# EAGLE design 2p_behavior (EAGLE 9.3.2)
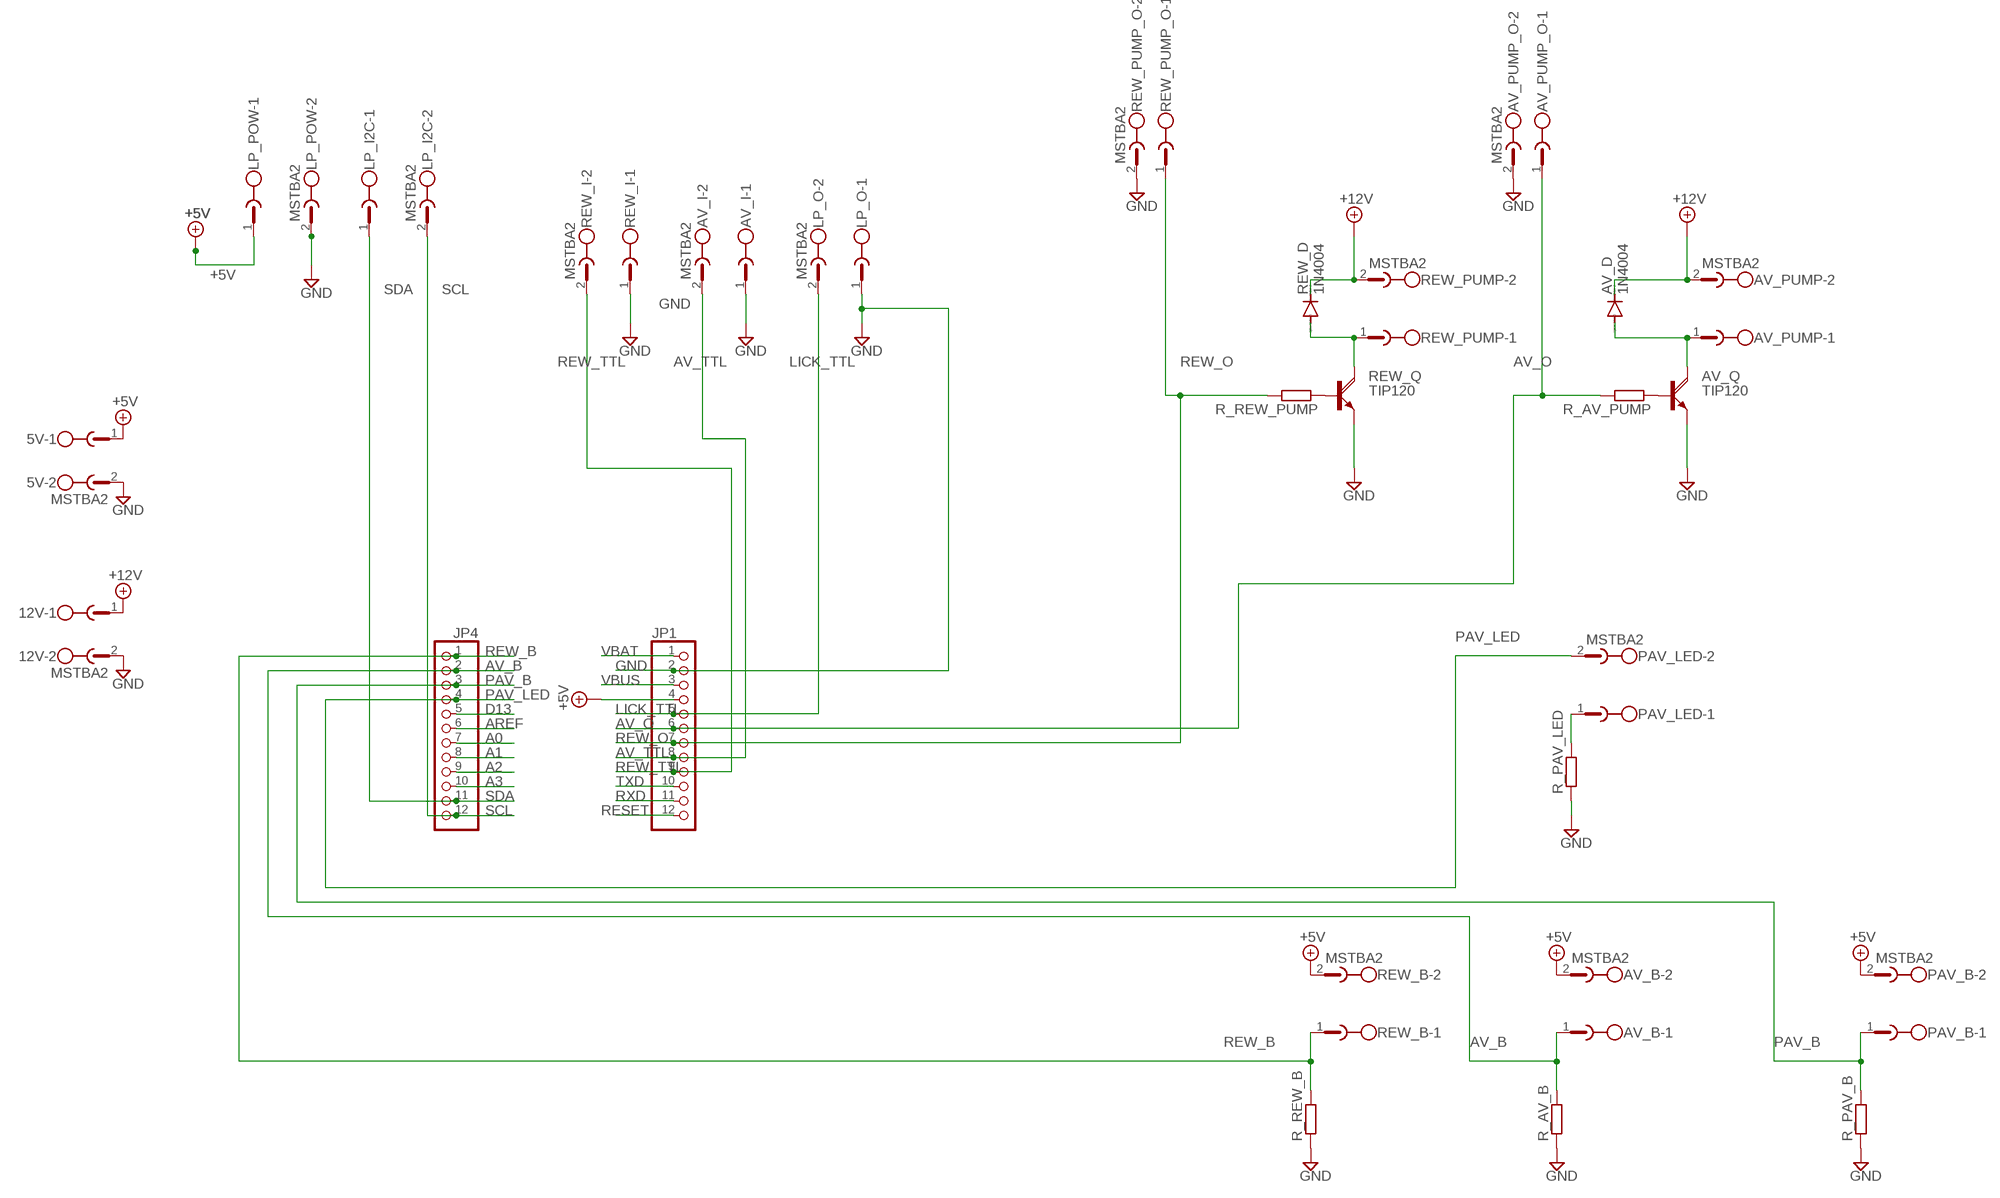
[diagram p0: schematic, sheet 1]

## Parts
5V  MSTBA2  [MSTBA2]
12V  MSTBA2  [MSTBA2]
AV_B  MSTBA2  [MSTBA2]
AV_D  1N4004  [DO41-10]
AV_I  MSTBA2  [MSTBA2]
AV_PUMP  MSTBA2  [MSTBA2]
AV_PUMP_O  MSTBA2  [MSTBA2]
AV_Q  TIP120  [TO220AH]
JP1  PINHD-1X12-CB  [1X12-CB]
JP4  PINHD-1X12-CB  [1X12-CB]
LP_I2C  MSTBA2  [MSTBA2]
LP_O  MSTBA2  [MSTBA2]
LP_POW  MSTBA2  [MSTBA2]
PAV_B  MSTBA2  [MSTBA2]
PAV_LED  MSTBA2  [MSTBA2]
R_AV_B  R-EU_0207/5V  [0207/5V]
R_AV_PUMP  R-EU_0207/5V  [0207/5V]
R_PAV_B  R-EU_0207/5V  [0207/5V]
R_PAV_LED  R-EU_0207/5V  [0207/5V]
R_REW_B  R-EU_0207/5V  [0207/5V]
R_REW_PUMP  R-EU_0207/5V  [0207/5V]
REW_B  MSTBA2  [MSTBA2]
REW_D  1N4004  [DO41-10]
REW_I  MSTBA2  [MSTBA2]
REW_PUMP  MSTBA2  [MSTBA2]
REW_PUMP_O  MSTBA2  [MSTBA2]
REW_Q  TIP120  [TO220AH]

## Nets
+5V: 5V.1 AV_B.2 JP1.4 LP_POW.1 PAV_B.2 REW_B.2
+12V: 12V.1 AV_D.C AV_PUMP.2 REW_D.C REW_PUMP.2
A0: JP4.7
A1: JP4.8
A2: JP4.9
A3: JP4.10
AREF: JP4.6
AV_B: AV_B.1 JP4.2 R_AV_B.2
AV_O: AV_PUMP_O.1 JP1.6 R_AV_PUMP.2
AV_TTL: AV_I.2 JP1.8
D13: JP4.5
GND: 5V.2 12V.2 AV_I.1 AV_PUMP_O.2 AV_Q.E JP1.2 LP_O.1 LP_POW.2 R_AV_B.1 R_PAV_B.1 R_PAV_LED.1 R_REW_B.1 REW_I.1 REW_PUMP_O.2 REW_Q.E
LICK_TTL: JP1.5 LP_O.2
N$1: PAV_LED.1 R_PAV_LED.2
N$2: R_REW_PUMP.1 REW_Q.B
N$3: REW_D.A REW_PUMP.1 REW_Q.C
N$4: AV_Q.B R_AV_PUMP.1
N$5: AV_D.A AV_PUMP.1 AV_Q.C
PAV_B: JP4.3 PAV_B.1 R_PAV_B.2
PAV_LED: JP4.4 PAV_LED.2
RESET: JP1.12
REW_B: JP4.1 R_REW_B.2 REW_B.1
REW_O: JP1.7 R_REW_PUMP.2 REW_PUMP_O.1
REW_TTL: JP1.9 REW_I.2
RXD: JP1.11
SCL: JP4.12 LP_I2C.2
SDA: JP4.11 LP_I2C.1
TXD: JP1.10
VBAT [power]: JP1.1
VBUS [power]: JP1.3

## Library data of the parts
5V 12V AV_B AV_I AV_PUMP AV_PUMP_O LP_I2C LP_O LP_POW PAV_B PAV_LED REW_B REW_I REW_PUMP REW_PUMP_O = con-phoenix-508:MSTBA2: PHOENIX; MF: FARNELL; MPN: 1757242; OC_FARNELL: 3705171; OC_NEWARK: 71C4161
AV_D REW_D = diode:1N4004: DIODE general purpose rectifier, 1 A
AV_Q REW_Q = transistor-power:TIP120: NPN DARLINGTON TRANSISTOR
JP1 JP4 = adafruit:PINHD-1X12: PIN HEADER
R_AV_B R_AV_PUMP R_PAV_B R_PAV_LED R_REW_B R_REW_PUMP = rcl:R-EU_: RESISTOR, European symbol; SPICEPREFIX: R

## Net classes
1 power: width 0.305 mm

## Board
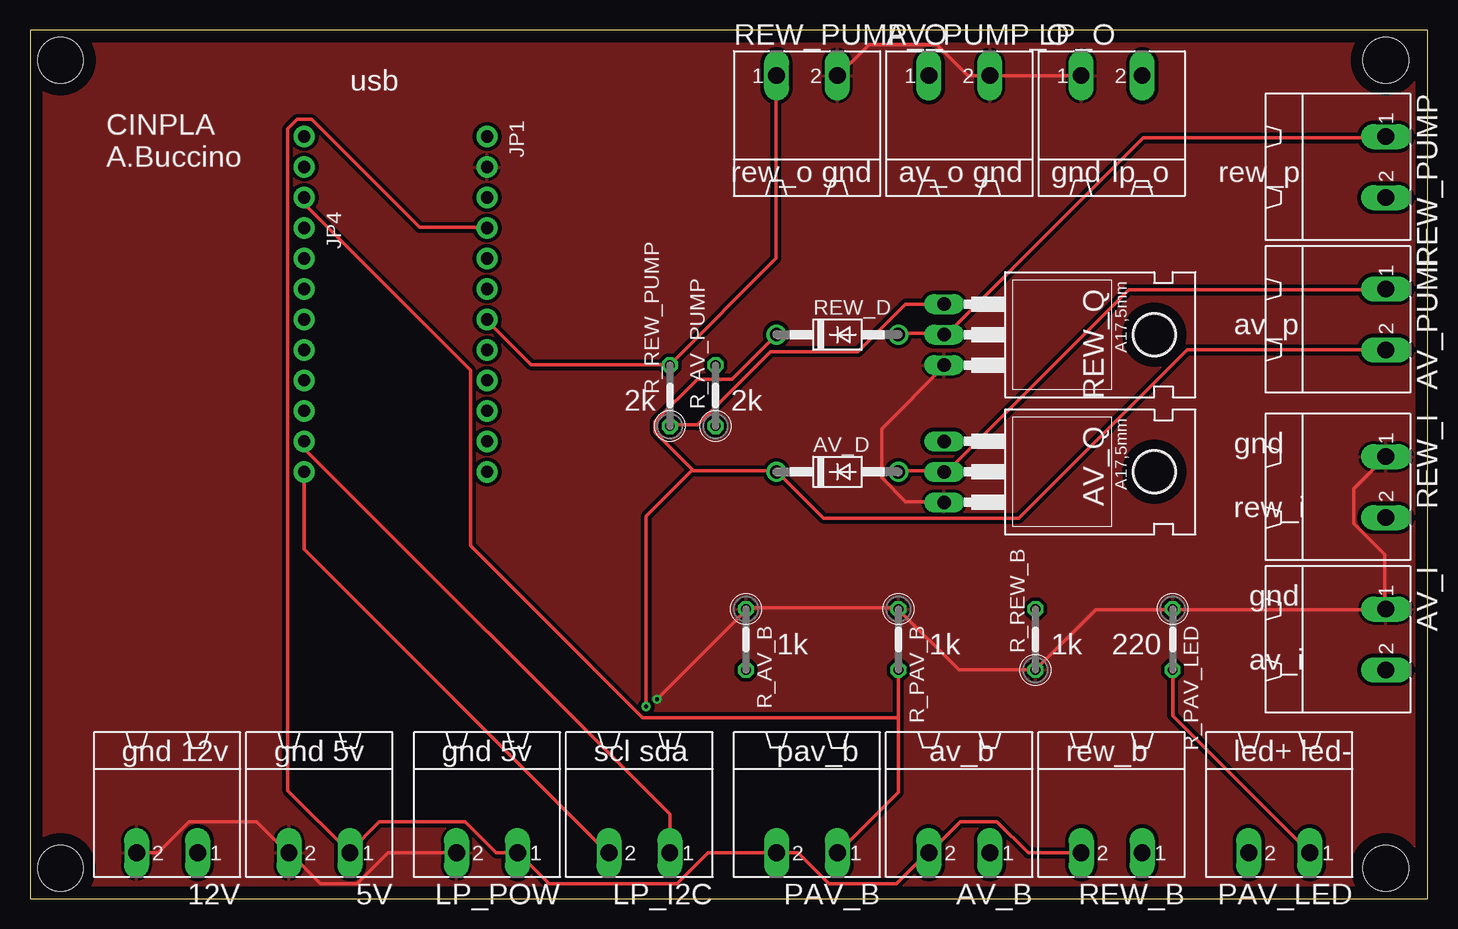
[diagram p1: board, top side]
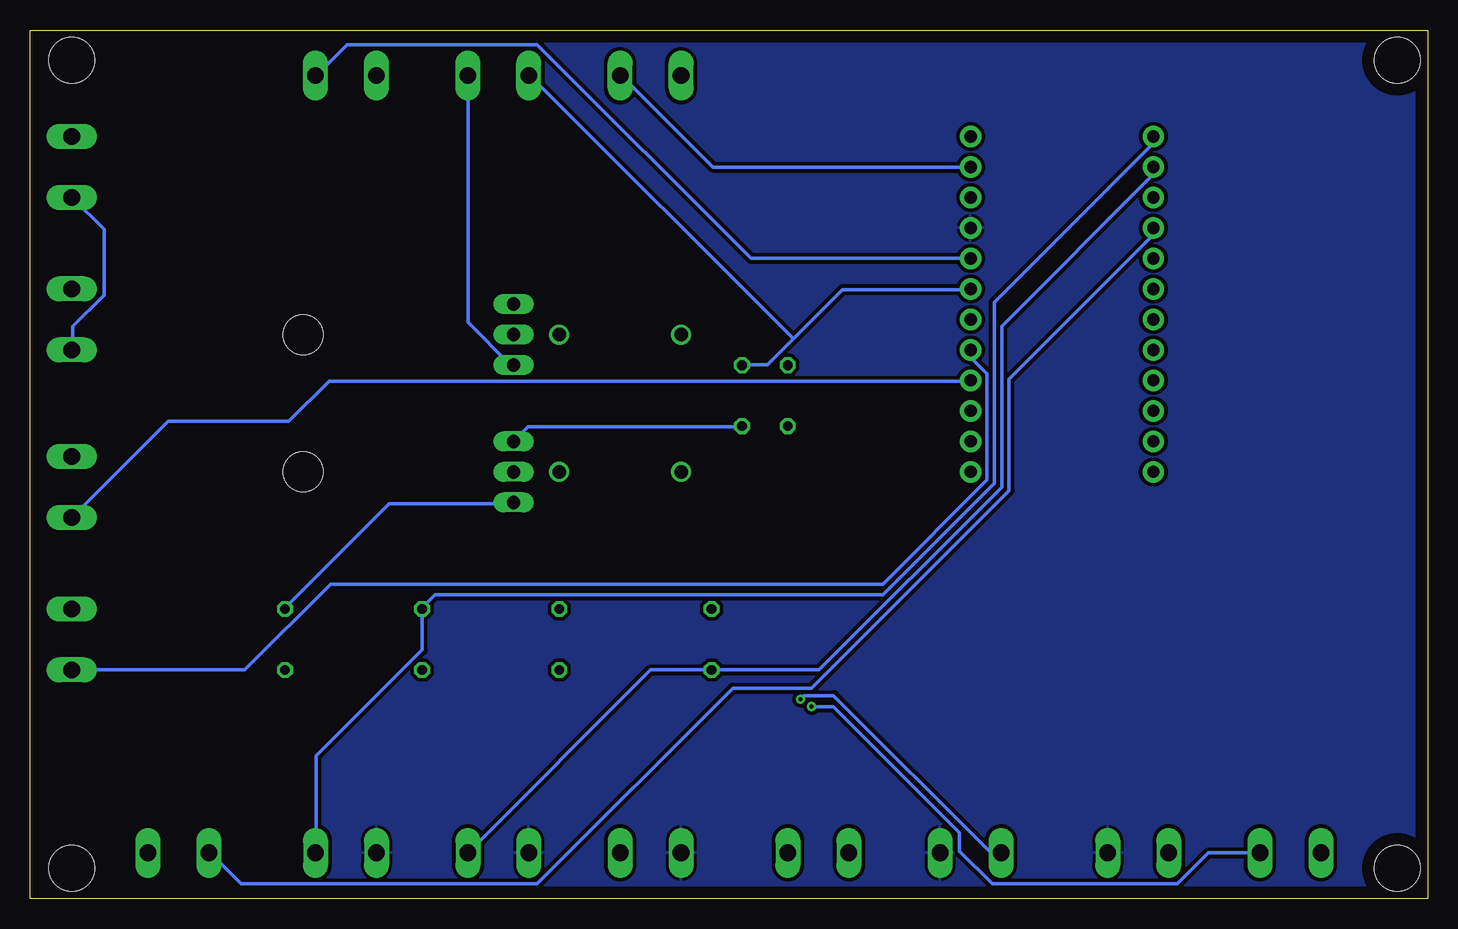
[diagram p2: board, bottom side, seen from below]

Size 116.51 x 72.38 mm. Coordinates in mm from the lower left corner, seen from the top.
Outline: 0,0 116.51,0 116.51,72.38 0,72.38 0,0
Copper layers (1*16): Top 0.035mm / dielectric 1.5mm / Bottom 0.035mm
Design rules "default *": minimum track width 12mil, minimum drill 0.35mm, track to track 12mil, track to pad 12mil, pad to pad 12mil, via to via 12mil, smd to smd 6mil, copper to edge 40mil, drill to drill 6mil, minimum pad ring 10mil, minimum via ring 8mil, stop-mask expansion 4mil, vias tented up to drill 0mil, thermal gap 10mil
Holes 3.81 mm at 2.54,69.85 2.54,2.54 113.03,2.54 113.03,69.85

### Footprints (pad centres in the part's own frame; a part is rotated, then mirrored left to right if it is on the bottom)
MSTBA2 = drill 1.397 long: 1 -2.54,5.08; 2 2.54,5.08
DO41-10 = drill 1.118: A 5.08,0; C -5.08,0
TO220AH = drill 1.118 long: B -2.54,-6.35; C 0,-6.35; E 2.54,-6.35 | hole 3.302: 0,11.176
1X12-CB = drill 1.016 pad 1.778: 1 -13.97,0; 2 -11.43,0; 3 -8.89,0; 4 -6.35,0; 5 -3.81,0; 6 -1.27,0; 7 1.27,0; 8 3.81,0; 9 6.35,0; 10 8.89,0; 11 11.43,0; 12 13.97,0
0207/5V = drill 0.813 octagon: 1 -2.54,0; 2 2.54,0

### Placement (x,y rotation side)
5V  24.13,8.89 180 top
12V  11.43,8.89 180 top
AV_B  77.47,8.89 180 top
AV_D  67.31,35.56 0 top
AV_I  107.95,21.59 270 top
AV_PUMP  107.95,48.26 270 top
AV_PUMP_O  77.47,63.5 0 top
AV_Q  82.55,35.56 270 top
JP1  38.1,49.53 270 top
JP4  22.86,49.53 270 top
LP_I2C  50.8,8.89 180 top
LP_O  90.17,63.5 0 top
LP_POW  38.1,8.89 180 top
PAV_B  64.77,8.89 180 top
PAV_LED  104.14,8.89 180 top
R_AV_B  59.69,21.59 270 top
R_AV_PUMP  57.15,41.91 90 top
R_PAV_B  72.39,21.59 270 top
R_PAV_LED  95.25,21.59 270 top
R_REW_B  83.82,21.59 90 top
R_REW_PUMP  53.34,41.91 90 top
REW_B  90.17,8.89 180 top
REW_D  67.31,46.99 0 top
REW_I  107.95,34.29 270 top
REW_PUMP  107.95,60.96 270 top
REW_PUMP_O  64.77,63.5 0 top
REW_Q  82.55,46.99 270 top

### Tracks (layer width: path | path; a pad name or v marks a point on that pad's centre or on a via)
+5V
  Top 0.305: REW_B.2 83.21,3.81 80.62,6.4 77.57,6.4 74.98,3.81 AV_B.2 74.83,3.81 72.24,1.22 66.6,1.22 64.01,3.81 PAV_B.2 56.54,3.81 53.95,1.22 43.28,1.22 40.69,3.81 LP_POW.1 38.86,3.81 36.27,6.4 29.11,6.4 26.67,3.96 5V.1 21.49,8.99 21.49,64.16 22.25,64.92 23.47,64.92 32.46,55.93 38.1,55.93 JP1.4
  pour Bottom: 0,72.39 0,0 116.84,0 116.84,72.39
+12V  (via drill 0.35)
  Top 0.305: 55.24,35.74 52.12,38.86 52.12,39.78 55.63,43.28 58.52,43.28 REW_D.C | 55.24,35.74 55.32,35.66 62.18,35.66 AV_D.C 62.33,35.51 66.14,31.7 82.45,31.7 96.47,45.72 AV_PUMP.2 | v51.36,16 51.36,31.85 55.24,35.74
  Bottom 0.305: AV_PUMP.2 112.93,45.72 112.93,47.7 110.34,50.29 110.34,55.78 112.93,58.37 REW_PUMP.2 | 12V.1 18.29,3.81 20.88,1.22 36.27,1.22 39.01,3.96 39.01,5.49 49.53,16 v51.36,16
AV_B
  Bottom 0.305: AV_B.1 64.77,19.05 R_AV_B.2 50.75,19.05 35.51,34.29 35.51,47.7 22.86,60.35 JP4.2
AV_O
  Bottom 0.305: 52.88,46.63 48.77,50.75 38.1,50.75 JP1.6 | 52.88,46.63 55.02,44.5 57.15,44.5 R_AV_PUMP.2 | 52.88,46.63 74.83,68.58 AV_PUMP_O.1
AV_TTL
  Bottom 0.305: JP1.8 38.1,45.11 36.73,43.74 36.73,34.9 45.41,26.21 91.44,26.21 98.6,19.05 AV_I.2
GND  (via drill 0.35)
  Top 0.305: LP_O.1 AV_PUMP_O.2 78.18,68.58 75.59,71.17 69.95,71.17 67.36,68.58 REW_PUMP_O.2 | 12V.2 10.67,3.81 13.26,6.4 18.9,6.4 21.49,3.81 5V.2 21.64,3.81 24.23,1.22 27.28,1.22 29.87,3.81 LP_POW.2 | REW_I.1 110.34,34.14 110.34,31.24 112.93,28.65 112.93,24.23 AV_I.1 112.93,24.08 95.25,24.08 | AV_Q.E 76.2,33.07 73,33.07 71.02,35.05 71.02,39.17 76.2,44.35 REW_Q.E | 95.25,24.08 88.85,24.08 R_REW_B.1 77.42,19.05 72.39,24.08 R_PAV_B.1 72.39,24.23 59.74,24.23 R_AV_B.1 59.74,24.08 v52.27,16.61 | 95.25,24.08 R_PAV_LED.1
  Bottom 0.305: JP1.2 59.59,60.96 67.21,68.58 REW_PUMP_O.2 | AV_Q.E 76.2,32.92 86.56,32.92 95.25,24.23 R_PAV_LED.1 | LP_POW.2 36.42,3.81 49.53,16.92 51.97,16.92 v52.27,16.61 | AV_PUMP_O.2 80.01,48.01 76.5,44.5 76.2,44.5 REW_Q.E
  pour Top: 0,72.39 0,0 116.84,0 116.84,72.39
LICK_TTL
  Bottom 0.305: JP1.5 56.39,53.34 74.22,71.17 90.07,71.17 92.66,68.58 LP_O.2
N$1
  Top 0.305: R_PAV_LED.2 95.25,15.24 PAV_LED.1
N$2
  Top 0.305: REW_Q.B 73,49.53 69.04,45.57 61.72,45.57 55.63,39.47 53.34,39.47 R_REW_PUMP.1
N$3
  Top 0.305: 76.2,47.09 72.39,47.09 REW_D.A | 76.2,47.09 76.5,47.09 92.81,63.4 112.93,63.4 REW_PUMP.1 | 76.2,47.09 REW_Q.C
N$4
  Bottom 0.305: AV_Q.B 74.98,39.32 57.15,39.32 R_AV_PUMP.1
N$5
  Top 0.305: 76.2,35.66 72.39,35.66 AV_D.A | 76.2,35.66 76.5,35.66 91.59,50.75 112.93,50.75 AV_PUMP.1 | 76.2,35.66 AV_Q.C
PAV_B
  Top 0.305: 72.39,15.09 72.39,8.84 67.36,3.81 PAV_B.1 | 72.39,15.09 R_PAV_B.2 | JP4.3 22.86,57.91 36.73,44.04 36.73,29.41 51.05,15.09 72.39,15.09
PAV_LED
  Bottom 0.305: JP4.4 22.86,55.32 34.9,43.28 34.9,33.98 51.36,17.53 57.91,17.53 74.22,1.22 98.91,1.22 101.5,3.81 PAV_LED.2
REW_B
  Bottom 0.305: REW_B.1 92.66,3.81 92.66,11.89 83.82,20.73 R_REW_B.2 83.82,24.23 82.75,25.3 45.41,25.3 36.12,34.59 36.12,49.68 22.86,62.94 JP4.1
REW_O
  Top 0.305: 53.34,44.5 41.76,44.5 38.1,48.16 JP1.7 | 53.34,44.5 62.18,53.34 62.18,68.58 REW_PUMP_O.1 | 53.34,44.5 R_REW_PUMP.2
REW_TTL
  Bottom 0.305: REW_I.2 105,39.78 94.94,39.78 91.59,43.13 38.1,43.13 JP1.9
SCL
  Top 0.305: JP4.12 22.86,29.11 48.16,3.81 LP_I2C.2
SDA
  Top 0.305: JP4.11 22.86,37.49 53.34,7.01 LP_I2C.1

### Text on the board
tPlace: usb | CINPLA / A.Buccino | rew_o gnd | av_o gnd | gnd | lp_o | rew_p | av_p | 2k | 2k | gnd / / rew_i | 1k | 1k | 1k | 220 | gnd / / av_i | gnd 12v | gnd 5v | gnd 5v | scl sda | pav_b | av_b | rew_b | led+ led-